# Altium schematic sheet POWER.SchDoc: Power Supply
size 420 x 297 mm; SheetNumber: 2; SheetTotal: 10
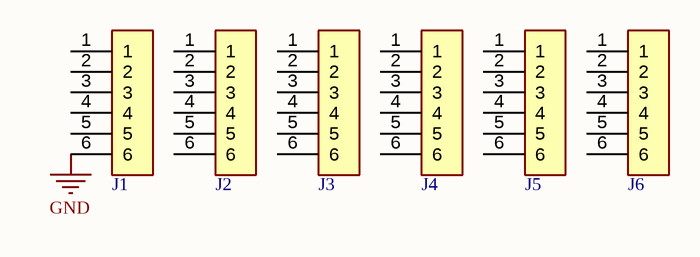
[diagram p0: POWER.SchDoc]

## Parts
J1  6PX1R_M  [6PX1R_M_STK20]  (value not drawn)
J2  6PX1R_M  [6PX1R_M_STK20]  (value not drawn)
J3  6PX1R_M  [6PX1R_M_STK20]  (value not drawn)
J4  6PX1R_M  [6PX1R_M_STK20]  (value not drawn)
J5  6PX1R_M  [6PX1R_M_STK20]  (value not drawn)
J6  6PX1R_M  [6PX1R_M_STK20]  (value not drawn)

## Nets
GND: J1.6

Not connected (* = marked no-connect by the designer): J1 1 2 3 4 5; J2 1 2 3 4 5 6; J3 1 2 3 4 5 6; J4 1 2 3 4 5 6; J5 1 2 3 4 5 6; J6 1 2 3 4 5 6

## Notes on the sheet
- PROJECT
- SIZE
- FILE NAME
- A3
- TITLE
- SHEET
- OF
- REV

## Library data of the parts
J1-J6 = 6PX1R_M: 6PX1R Male Header; Value: *; Manufacturer 1: *; Manufacturer Part Number 1: *